# EAGLE design spo2_module_v2.0.1_nov2023 (EAGLE 9.6.2)

## Sheet 1 of 2: Connectors
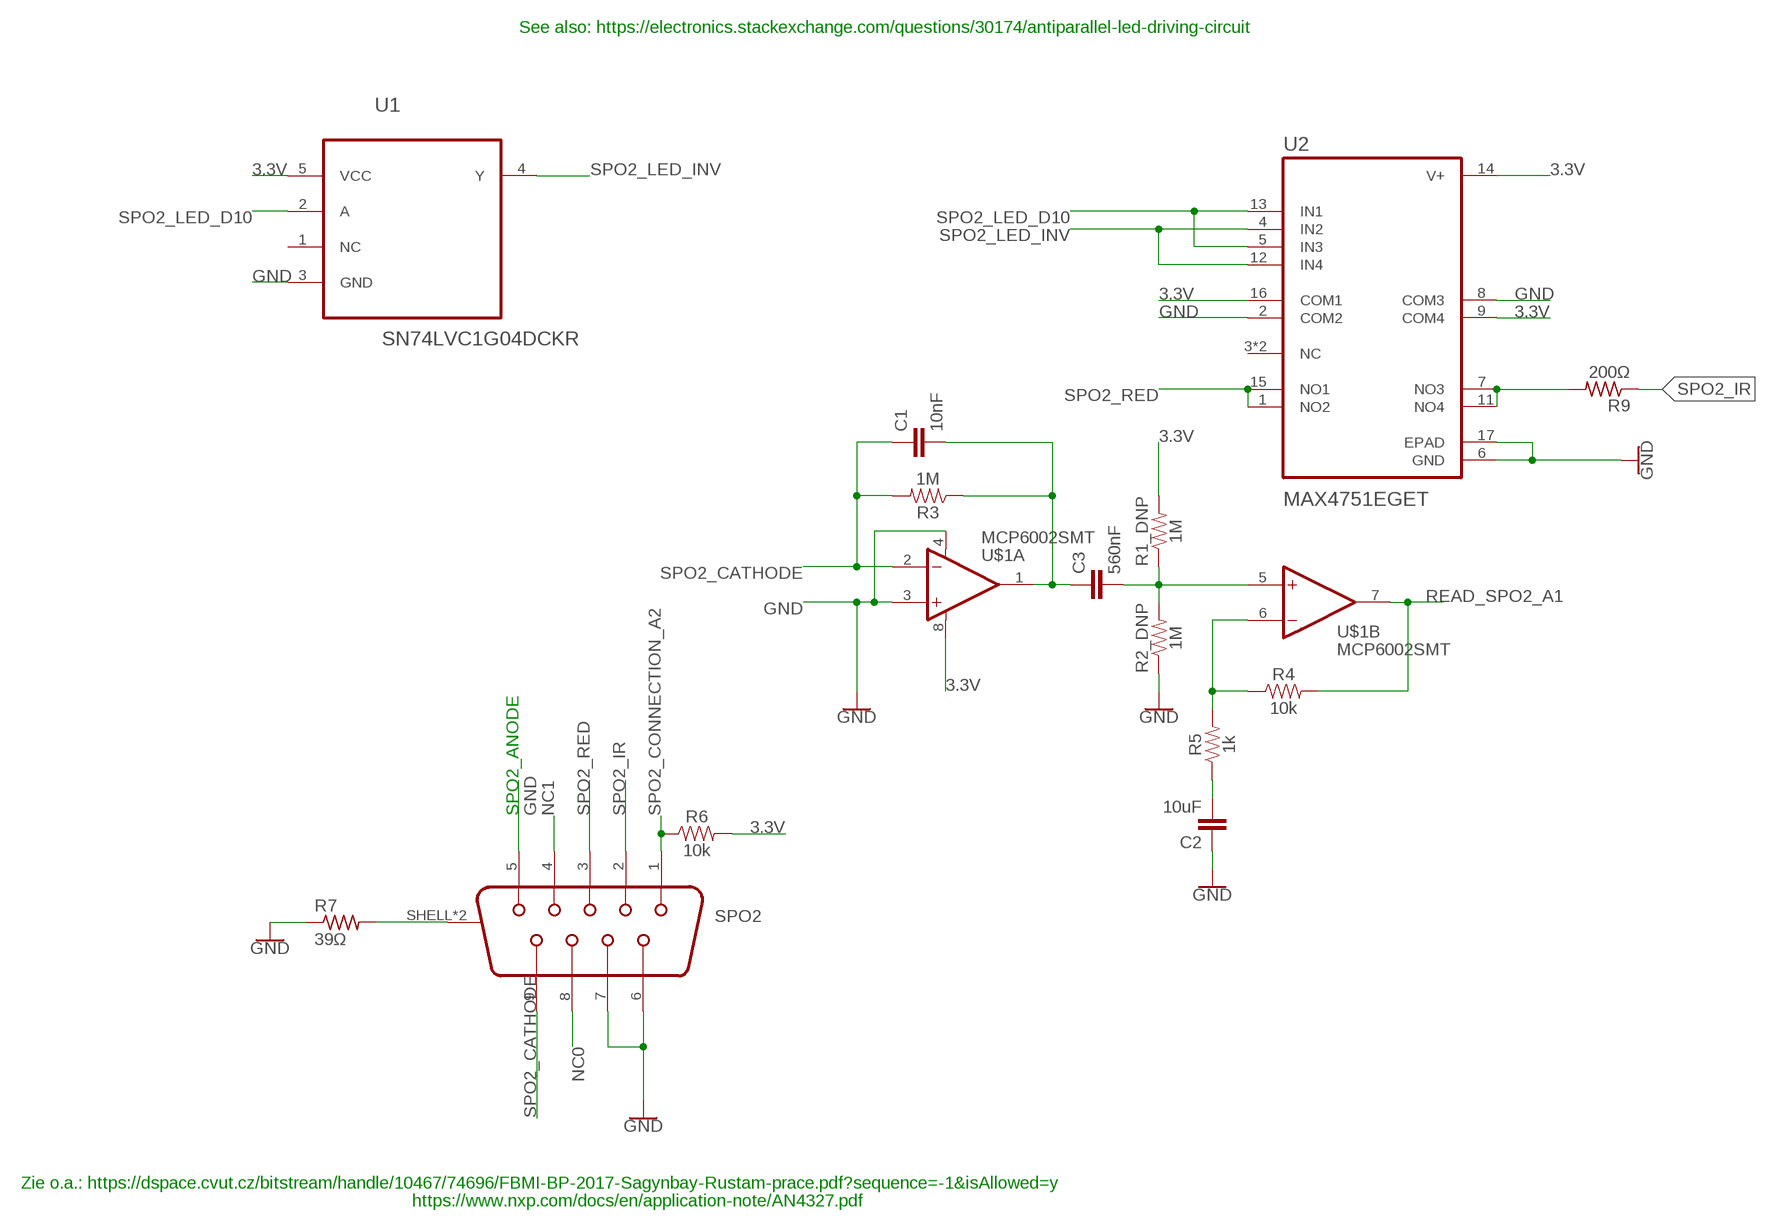
[diagram p0: schematic, sheet 1]

### Parts
C1  10nF  10NF-0603-50V-10%  [0603]
C2  10uF  C-EUC0603  [C0603]
C3  560nF  C-EUC0603  [C0603]
R1_DNP  1M  1MOHM-0603-1/4W-5%  [0603]
R2_DNP  1M  1MOHM-0603-1/4W-5%  [0603]
R3  1M  1MOHM-0603-1/4W-5%  [0603]
R4  10k  10KOHM-0603-1/10W-1%  [0603]
R5  1k  1KOHM-0603-1/10W-1%  [0603]
R6  10k  10KOHM-0603-1/10W-1%  [0603]
R7  39Ω  R-US_R0603  [R0603]
R9  200Ω  R-US_R0603  [R0603]
SPO2  618009231121  [618009231121]
U1  SN74LVC1G04DCKR  [SOT65P210X110-5N]
U2  MAX4751EGET  [QFN50P300X300X90-17N]
U$1  MCP6002SMT  [SOIC8]

### Nets
3.3V: R1_DNP.2 R6.2 U1.5(VCC) U2.9(COM4) U2.14(V+) U2.16(COM1) U$1.8(A:V+) ; also sheet 2
GND: C2.1 R2_DNP.1 R7.1 SPO2.5 SPO2.6 SPO2.7 U1.3(GND) U2.2(COM2) U2.6(GND) U2.8(COM3) U2.17(EPAD) U$1.3(A:+IN) U$1.4(A:V-) ; also sheet 2
N$2: C3.2 R1_DNP.1 R2_DNP.2 U$1.5(B:+IN)
N$4: C1.2 C3.1 R3.1 U$1.1(A:OUT)
N$6: R7.2 SPO2.SHELL1(SHIELD) SPO2.SHELL(SHIELD)
N$7: R4.1 R5.2 U$1.6(B:-IN)
N$9: R9.2 U2.7(NO3) U2.11(NO4)
N$13: C2.2 R5.1
NC0: SPO2.8
NC1: SPO2.4
READ_SPO2_A1: R4.2 U$1.7(B:OUT) ; also sheet 2
SPO2_CATHODE: C1.1 R3.2 SPO2.9 U$1.2(A:-IN)
SPO2_CONNECTION_A2: R6.1 SPO2.1 ; also sheet 2
SPO2_IR: R9.1 SPO2.2
SPO2_LED_D10: U1.2(A) U2.5(IN3) U2.13(IN1) ; also sheet 2
SPO2_LED_INV: U1.4(Y) U2.4(IN2) U2.12(IN4)
SPO2_RED: SPO2.3 U2.1(NO2) U2.15(NO1)
Unconnected: U1.1(NC) U2.3(NC) U2.10(NC)

### Notes on the sheet
- See also: https://electronics.stackexchange.com/questions/30174/antiparallel-led-driving-circuit
- SPO2_ANODE
- Zie o.a.: https://dspace.cvut.cz/bitstream/handle/10467/74696/FBMI-BP-2017-Sagynbay-Rustam-prace.pdf?sequence=-1&isAllowed=y
- https://www.nxp.com/docs/en/application-note/AN4327.pdf

## Sheet 2 of 2: Microcontroller
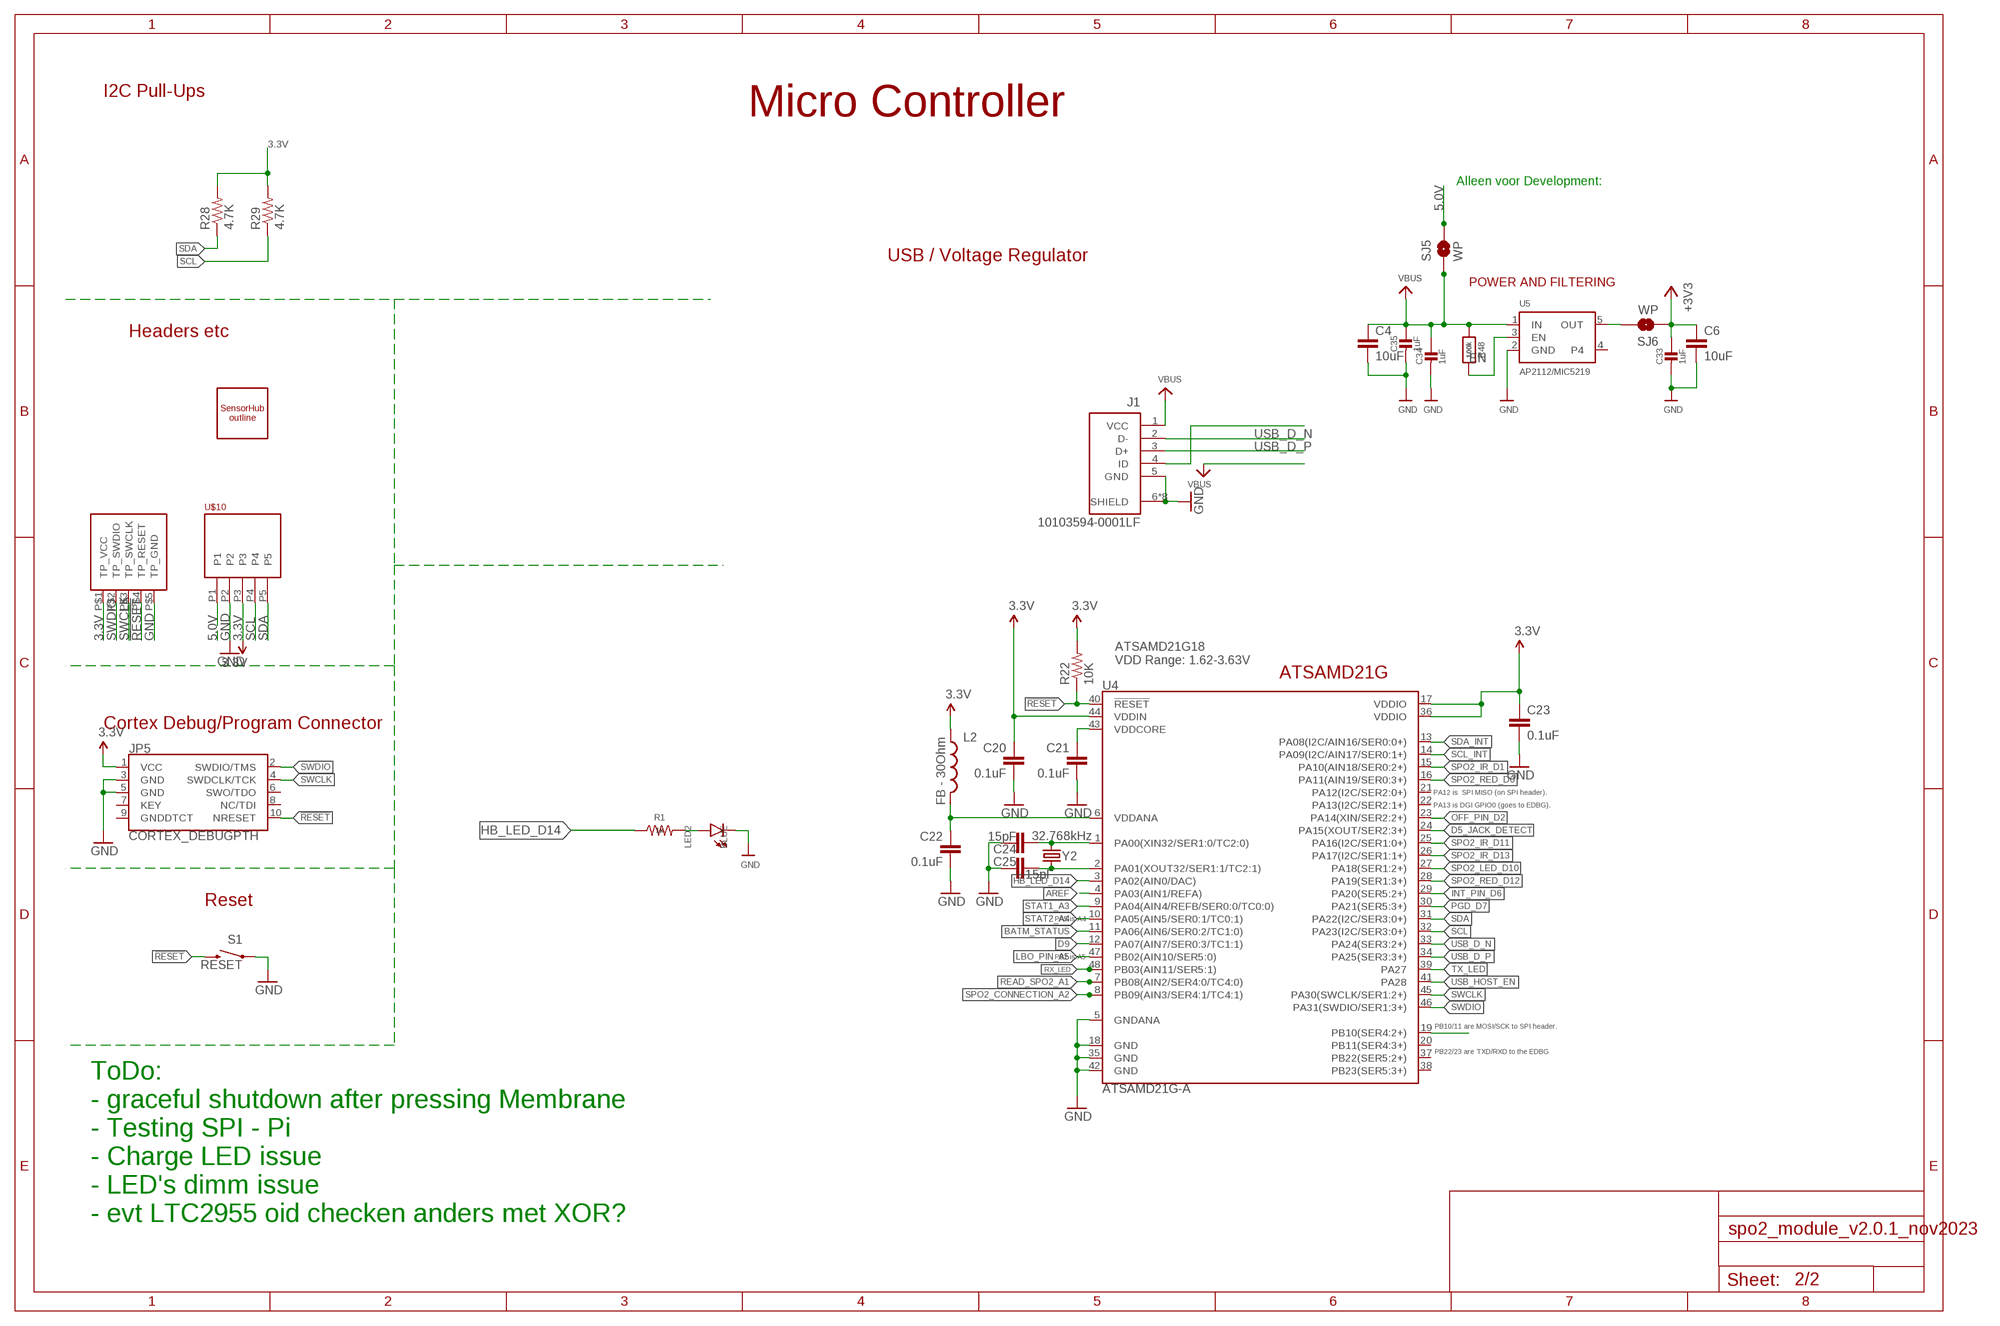
[diagram p1: schematic, sheet 2]

### Parts
C4  10uF  10UF-0603-6.3V-20%  [0603]
C6  10uF  10UF-0603-6.3V-20%  [0603]
C20  0.1uF  0.1UF-16V(+-10%)(0402)  [0402-CAP]
C21  0.1uF  0.1UF-0603-25V-(+80/-20%)  [0603]
C22  0.1uF  0.1UF-16V(+-10%)(0402)  [0402-CAP]
C23  0.1uF  0.1UF-16V(+-10%)(0402)  [0402-CAP]
C24  15pF  15PF-50V(+-5%)(0402)  [0402-CAP]
C25  15pF  15PF-50V(+-5%)(0402)  [0402-CAP]
C33  1uF  CAP_CERAMIC0603_NO  [0603-NO]
C34  1uF  CAP_CERAMIC0603_NO  [0603-NO]
C35  1uF  CAP_CERAMIC0603_NO  [0603-NO]
J1  10103594-0001LF  [AMPHENOL_10103594-0001LF]
JP5  CORTEX_DEBUGPTH  [2X5-PTH-1.27MM]
L2  FB - 30Ohm  INDUCTOR0603  [0603]
LED2  BLUE  LEDCHIP-LED0603  [CHIP-LED0603]
R1  1k  1KOHM-0603-1/10W-1%  [0603]
R22  10K  10KOHM-1/10W-1%(0603)0603  [0603-RES]
R28  4.7K  4.7KOHM-1/10W-1%(0603)  [0603-RES]
R29  4.7K  4.7KOHM-1/10W-1%(0603)  [0603-RES]
R48  100k  RESISTOR_0603_NOOUT  [0603-NO@1]
S1  RESET  SWITCH-MOMENTARY-2SMD-4.6X2.8MM  [TACTILE_SWITCH_SMD_4.6X2.8MM]
SJ5  WP  JUMPER-SMT_2_NO_NO-SILK  [SMT-JUMPER_2_NO_NO-SILK]
SJ6  WP  JUMPER-SMT_2_NO_NO-SILK  [SMT-JUMPER_2_NO_NO-SILK]
U4  ATSAMD21G-A  [TQFP-48]
U5  AP2112/MIC5219  VREG_SOT23-5  [SOT23-5]
U$5  HUB_TESTPINSHUBS  [TEST_PINS]
U$10  PHOENIX_PTSM_M5_TH_I2C++  [PTSM_M5_THRHOLE]
U$12  SENSORHUB_PROFILEUSB_LEFT  [SENSORHUB_OUTLINE_USB_NOTCH_LEFT]
Y2  32.768kHz  CRYSTAL3.2X1.5MM  [CRYSTAL-SMD-3.2X1.5MM]

### Nets
3.3V: C6.1 C20.1 C23.1 C33.1 JP5.1(VCC) L2.1 R22.2 R28.2 R29.2 SJ6.1 U4.17(VDDIO) U4.36(VDDIO) U4.44(VDDIN) U$5.P$1(TP_VCC) U$10.P3 ; supply symbol labelled +3V3 ; also sheet 1
5.0V: SJ5.2 U$10.P1
!RESET: JP5.10(NRESET) R22.1 S1.3 S1.4 U4.40(!RESET!) U$5.P$4(TP_RESET)
AREF: U4.4(PA03(AIN1/REFA))
BATM_STATUS: U4.11(PA06(AIN6/SER0:2/TC1:0))
D5_JACK_DETECT: U4.24(PA15(XOUT/SER2:3+))
D9: U4.12(PA07(AIN7/SER0:3/TC1:1))
EN: R48.2 U5.3(EN)
GND: C4.2 C6.2 C20.2 C21.2 C22.2 C23.2 C24.1 C25.2 C33.2 C34.2 C35.2 J1.5(GND) J1.6(SHIELD) J1.7(SHIELD) J1.8(SHIELD) J1.9(SHIELD) J1.10(SHIELD) J1.11(SHIELD) J1.S1(SHIELD) J1.S2(SHIELD) JP5.3(GND) JP5.5(GND) LED2.C S1.1 S1.2 U4.5(GNDANA) U4.18(GND) U4.35(GND) U4.42(GND) U5.2(GND) U$5.P$5(TP_GND) U$10.P2 ; also sheet 1
HB_LED_D14: R1.1 U4.3(PA02(AIN0/DAC))
INT_PIN_D6: U4.29(PA20(SER5:2+))
LBO_PIN_A5: U4.47(PB02(AIN10/SER5:0))
N$3: J1.4(ID)
N$5: LED2.A R1.2
N$21: U4.19(PB10(SER4:2+))
N$46: C24.2 U4.1(PA00(XIN32/SER1:0/TC2:0)) Y2.P$2
N$47: C25.1 U4.2(PA01(XOUT32/SER1:1/TC2:1)) Y2.P$1
OFF_PIN_D2: U4.23(PA14(XIN/SER2:2+))
OUT: SJ6.2 U5.5(OUT)
PGD_D7: U4.30(PA21(SER5:3+))
READ_SPO2_A1: U4.7(PB08(AIN2/SER4:0/TC4:0)) ; also sheet 1
RX_LED: U4.48(PB03(AIN11/SER5:1))
SCL: R29.1 U4.32(PA23(I2C/SER3:0+)) U$10.P4
SCL_INT: U4.14(PA09(I2C/AIN17/SER0:1+))
SDA: R28.1 U4.31(PA22(I2C/SER3:0+)) U$10.P5
SDA_INT: U4.13(PA08(I2C/AIN16/SER0:0+))
SPO2_CONNECTION_A2: U4.8(PB09(AIN3/SER4:1/TC4:1)) ; also sheet 1
SPO2_IR_D1: U4.15(PA10(AIN18/SER0:2+))
SPO2_IR_D11: U4.25(PA16(I2C/SER1:0+))
SPO2_IR_D13: U4.26(PA17(I2C/SER1:1+))
SPO2_LED_D10: U4.27(PA18(SER1:2+)) ; also sheet 1
SPO2_RED_D0: U4.16(PA11(AIN19/SER0:3+))
SPO2_RED_D12: U4.28(PA19(SER1:3+))
STAT1_A3: U4.9(PA04(AIN4/REFB/SER0:0/TC0:0))
STAT2_A4: U4.10(PA05(AIN5/SER0:1/TC0:1))
SWCLK: JP5.4(SWDCLK/TCK) U4.45(PA30(SWCLK/SER1:2+)) U$5.P$3(TP_SWCLK)
SWDIO: JP5.2(SWDIO/TMS) U4.46(PA31(SWDIO/SER1:3+)) U$5.P$2(TP_SWDIO)
TX_LED: U4.39(PA27)
USB_D_N: J1.2(D-) U4.33(PA24(SER3:2+))
USB_D_P: J1.3(D+) U4.34(PA25(SER3:3+))
USB_HOST_EN: U4.41(PA28)
VBUS: C4.1 C34.1 C35.1 J1.1(VCC) R48.1 SJ5.1 U5.1(IN)
VDDANA: C22.1 L2.2 U4.6(VDDANA)
VDDCORE: C21.1 U4.43(VDDCORE)
Unconnected: JP5.6(SWO/TDO) JP5.7(KEY) JP5.8(NC/TDI) JP5.9(GNDDTCT) U4.20(PB11(SER4:3+)) U4.21(PA12(I2C/SER2:0+)) U4.22(PA13(I2C/SER2:1+)) U4.37(PB22(SER5:2+)) U4.38(PB23(SER5:3+)) U5.4

### Notes on the sheet
- I2C Pull-Ups | Micro Controller
- Alleen voor Development:
- USB / Voltage Regulator
- POWER AND FILTERING
- Headers etc
- ATSAMD21G18
  VDD Range: 1.62-3.63V
- ATSAMD21G
- Cortex Debug/Program Connector
- PA12 is  SPI MISO (on SPI header).
- PA13 is DGI GPIO0 (goes to EDBG).
- Reset
- PA5 is A4
- PB2 is A5
- PB10/11 are MOSI/SCK to SPI header.
- PB22/23 are TXD/RXD to the EDBG
- ToDo:
  - graceful shutdown after pressing Membrane
  - Testing SPI - Pi
  - Charge LED issue
  - LED's dimm issue
  - evt LTC2955 oid checken anders met XOR?

## Library data of the parts
C1 = SparkFun-Capacitors:10NF: 0.01uF/10nF/10,000pF ceramic capacitors A capacitor is a passive two-terminal electrical component used to store electrical energy temporarily in an electric field. CAP-09321; PROD_ID: CAP-00867
C2 C3 = rcl:C-EU: CAPACITOR, European symbol; SPICEPREFIX: C
C4 C6 = SparkFun-Capacitors:10UF: 10.0µF ceramic capacitors A capacitor is a passive two-terminal electrical component used to store electrical energy temporarily in an electric field.; PROD_ID: CAP-11015
C20 C22 C23 = SparkFun-Capacitors:0.1UF-16V(+-10%)(0402); PROD_ID: CAP-12416
C21 = SparkFun-Capacitors:0.1UF: 0.1µF ceramic capacitors A capacitor is a passive two-terminal electrical component used to store electrical energy temporarily in an electric field.; PROD_ID: CAP-00810
C24 C25 = samd21-temp:15PF-50V(+-5%)(0402); PROD_ID: CAP-13063
C33-C35 = microbuilder:CAP_CERAMIC: Ceramic Capacitors For new designs, use the packages preceded by an '_' character since they are more reliable: The following footprints should be used on most boards: _0402 - Standard footprint for regular board layouts _0603 - Standard footprint for regular board layouts _0805 - Standard footprint for regular board layouts _1206 - Standard footprint for regular board layouts For extremely tight-pitch boards where space is at a premium, the following 'micro-pitch' footprints can be used (smaller pads, no silkscreen outline, etc.): _0402MP - Micro-pitch footprint for very dense/compact boards _0603MP - Micro-pitch footprint for very dense/compact boards _0805MP - Micro-pitch footprint for very dense/compact boards _1206MP - Micro-pitch footprint for very dense/compact boards
J1 = 10103594-0001LF:10103594-0001LF: USB - micro B USB 2.0 Receptacle Connector 5 Position Surface Mount, Right Angle; Through Hole Check availability <https://pricing.snapeda.com/parts/10103594-0001LF/AMPHENOL%20ICC%20/%20FCI/view-part?ref=eda>; AVAILABILITY: In Stock; DESCRIPTION: Micro USB 2.0, Input Output Connectors, B TYPE RECEPTACLE; MF: AMPHENOL ICC / FCI; MP: 10103594-0001LF; PACKAGE: None; PRICE: None; PURCHASE-URL: https://pricing.snapeda.com/search/part/10103594-0001LF/?ref=eda
JP5 = samd21-temp:CORTEX_DEBUG: Cortex Debug Connector Datasheet <http://infocenter.arm.com/help/topic/com.arm.doc.faqs/attached/13634/cortex_debug_connectors.pdf>
L2 = SparkFun-Passives:INDUCTOR: Inductors Basic Inductor/Choke - 0603 and 1206. Footprints are not proven and vary greatly between part numbers. INDUCTOR POWER 3.3UH 4.0A SMD 0.197" L x 0.197" W x 0.177" H (5.00mm x 5.00mm x 4.50mm); PROD_ID: RES-07859
LED2 = led:LED: LED OSRAM: - CHIPLED LG R971, LG N971, LY N971, LG Q971, LY Q971, LO R971, LY R971 LH N974, LH R974 LS Q976, LO Q976, LY Q976 LO Q996 - Hyper CHIPLED LW Q18S LB Q993, LB Q99A, LB R99A - SideLED LS A670, LO A670, LY A670, LG A670, LP A670 LB A673, LV A673, LT A673, LW A673 LH A674 LY A675 LS A676, LA A676, LO A676, LY A676, LW A676 LS A679, LY A679, LG A679 - Hyper Micro SIDELED® LS Y876, LA Y876, LO Y876, LY Y876 LT Y87S - SmartLED LW L88C, LW L88S LB L89C, LB L89S, LG L890 LS L89K, LO L89K, LY L89K LS L896, LA L896, LO L896, LY L896 - TOPLED LS T670, LO T670, LY T670, LG T670, LP T670 LSG T670, LSP T670, LSY T670, LOP T670, LYG T670 LG T671, LOG T671, LSG T671 LB T673, LV T673, LT T673, LW T673 LH T674 LS T676, LA T676, LO T676, LY T676, LB T676, LH T676, LSB T676, LW T676 LB T67C, LV T67C, LT T67C, LS T67K, LO T67K, LY T67K, LW E67C LS E67B, LA E67B, LO E67B, LY E67B, LB E67C, LV E67C, LT E67C LW T67C LS T679, LY T679, LG T679 LS T770, LO T770, LY T770, LG T770, LP T770 LB T773, LV T773, LT T773, LW T773 LH T774 LS E675, LA E675, LY E675, LS T675 LS T776, LA T776, LO T776, LY T776, LB T776 LHGB T686 LT T68C, LB T68C - Hyper Mini TOPLED® LB M676 - Mini TOPLED Santana® LG M470 LS M47K, LO M47K, LY M47K Source: http://www.osram.convergy.de LUXEON: - LUMILED® LXK2-PW12-R00, LXK2-PW12-S00, LXK2-PW14-U00, LXK2-PW14-V00 LXK2-PM12-R00, LXK2-PM12-S00, LXK2-PM14-U00 LXK2-PE12-Q00, LXK2-PE12-R00, LXK2-PE12-S00, LXK2-PE14-T00, LXK2-PE14-U00 LXK2-PB12-K00, LXK2-PB12-L00, LXK2-PB12-M00, LXK2-PB14-N00, LXK2-PB14-P00, LXK2-PB14-Q00 LXK2-PR12-L00, LXK2-PR12-M00, LXK2-PR14-Q00, LXK2-PR14-R00 LXK2-PD12-Q00, LXK2-PD12-R00, LXK2-PD12-S00 LXK2-PH12-R00, LXK2-PH12-S00 LXK2-PL12-P00, LXK2-PL12-Q00, LXK2-PL12-R00 Source: www.luxeon.com KINGBRIGHT: KA-3528ASYC Source: www.kingbright.com
R1 R5 = SparkFun-Resistors:1KOHM: 1kΩ resistor A resistor is a passive two-terminal electrical component that implements electrical resistance as a circuit element. Resistors act to reduce current flow, and, at the same time, act to lower voltage levels within circuits. - Wikipedia; PROD_ID: RES-07856
R1_DNP R2_DNP R3 = SparkFun-Resistors:1MOHM: 1MΩ resistor A resistor is a passive two-terminal electrical component that implements electrical resistance as a circuit element. Resistors act to reduce current flow, and, at the same time, act to lower voltage levels within circuits. - Wikipedia; PROD_ID: RES-07868
R4 R6 = SparkFun-Resistors:10KOHM: 10kΩ resistor A resistor is a passive two-terminal electrical component that implements electrical resistance as a circuit element. Resistors act to reduce current flow, and, at the same time, act to lower voltage levels within circuits. - Wikipedia; PROD_ID: RES-00824
R7 = adafruit:R-US_: RESISTOR, American symbol
R9 = rcl:R-US_: RESISTOR, American symbol; SPICEPREFIX: R
R22 = SparkFun-Resistors:10KOHM-1/10W-1%(0603): RES-00824; PROD_ID: RES-00824
R28 R29 = SparkFun-Resistors:4.7KOHM-1/10W-1%(0603): RES-07857; PROD_ID: RES-07857
R48 = microbuilder:RESISTOR: Resistors For new designs, use the packages preceded by an '_' character since they are more reliable: The following footprints should be used on most boards: _0402 - Standard footprint for regular board layouts _0603 - Standard footprint for regular board layouts _0805 - Standard footprint for regular board layouts _1206 - Standard footprint for regular board layouts For extremely tight-pitch boards where space is at a premium, the following 'micro-pitch' footprints can be used (smaller pads, no silkscreen outline, etc.): _0402MP - Micro-pitch footprint for very dense/compact boards _0603MP - Micro-pitch footprint for very dense/compact boards _0805MP - Micro-pitch footprint for very dense/compact boards _1206MP - Micro-pitch footprint for very dense/compact boards
S1 = samd21-temp:SWITCH-MOMENTARY-2: Various NO switches- pushbuttons, reed, etc; PROD_ID: SWCH-13065
SJ5 SJ6 = SparkFun-Jumpers:JUMPER-SMT_2_NO: Normally open jumper This jumper has two pads in close proximity to each other. Apply solder to close the connection. Round pads are easier to solder for beginners, but are a lot larger. SparkFun Product that uses the round pads: SparkFun EL Sequencer <https://www.sparkfun.com/products/12781>
SPO2 = InputOutputIO (rev19a):618009231121: WR-DSUB 8.08mm Female Angled PCB Connector with Hex Screw, 9 Pins=>Code : Con_I-O_DSUB_PCB_Female_w-screw_618009231121 <http://katalog.we-online.de/media/images/eican/Con_I-O_DSUB_PCB_Female_w-screw_6180xx231121_pf2.jpg> Details see: http://katalog.we-online.de/en/em/DSUB_FEMALE_ANGLED_PCB_CONNECTOR_W_HEX_SCREW_8_08MM_6180XX231121 Created 2014-07-10, Karrer Zheng 2014 (C) Würth Elektronik
U1 = SN74LVC1G04DCKR:SN74LVC1G04DCKR: SINGLE INVERTER GATE; AVAILABILITY: Unavailable; DESCRIPTION: Inverter 1-Element CMOS 5-Pin SC-70 T/R; MF: Texas Instruments; MP: SN74LVC1G04DCKR; PACKAGE: SC-70-5 Texas Instruments; PRICE: None
U2 = MAX4751EGET:MAX4751EGET; AVAILABILITY: Unavailable; DESCRIPTION: Analog Switch Quad SPST 16-Pin QFN; MF: Maxim Integrated; MP: MAX4751EGE+; PACKAGE: QFN-16 Maxim; PRICE: None
U4 = samd21-temp:ATSAMD21G: Atmel SAMD21G SMART ARM-Based Microcontroller The Atmel ® | SMART ™ SAM D21 is a series of low-power microcontrollers using the 32-bit ARM ® Cortex ® -M0+ processor, and ranging from 32- to 64-pins with up to 256KB Flash and 32KB of SRAM. The SAM D21 devices operate at a maximum frequency of 48MHz and reach 2.46 CoreMark/MHz. They are designed for simple and intuitive migration with identical peripheral modules, hex compatible code, identical linear address map and pin compatible migration paths between all devices in the product series. All devices include intelligent and flexible peripherals, Atmel Event System for inter-peripheral signaling, and support for capacitive touch button, slider and wheel user interfaces.; PROD_ID: IC-13064
U5 = microbuilder:VREG_SOT23-5: SOT23-5 Fixed Voltage Regulators Part Current Out V Out V In V Dropout θJA (°C/W) TJ (°C) Digikey Part No. ADP121 150mA 3.3V 3.4-5.5V 0.09V @ 150mA -- -- ADP121-AUJZ33R7CT-ND ADP121 150mA 3.0V 3.1-5.5V 0.09V @ 150mA -- -- ADP121-AUJZ30R7CT-ND ADP122 300mA 3.3V 3.4-5.5V 0.085V @ 300mA -- -- ADP122AUJZ-3.3-R7CT-ND ADP1712 300mA 3.3V 3.5-5.5V 0.17V @ 300mA -- -- ADP1712AUJZ-3.3-R7TR-ND AP7311 (Low Cost) 150mA 3.3V 3.5-6V 0.15V @ 150mA -- -- AP7311-33WG-7DICT-ND LD39015M18R 150mA 1.8V 1.9V-5.5V 0.08V @ 100mA -- -- 497-6977-1-ND LP2985A-33DBVR 150mA 3.3V 3.3-16V 0.28V @ 150mA 206 150 296-18479-1-ND MCP1824T-3302E/OT 300mA 3.3V 3.5V-6V 0.2V @ 300mA -- -- MCP1824T-3302E/OTCT-ND MIC5205-2.5YM5 TR 150mA 2.5V 2.7-16V 0.165V @ 150mA -- -- 576-1257-2-ND MIC5205-3.0YM5 TR 150mA 3.0V 3.2V-16V 0.165V @ 150mA -- -- 576-1258-2-ND MIC5205-3.3YM5 TR 150mA 3.3V 3.5V-16V 0.165V @ 150mA -- -- 576-1259-2-ND TPS780330220 150mA 3.3V+2.2V 3.6-5.5V 250mV Max -- -- 296-23332-1-ND TDA3663/N1,135 100mA 3.3V 3.5-45V 0.18V @ 50mA -- -- 568-5343-1-ND Max operating temp can be calculated using θJA, TJ (max junction temperature), and power in watts. Set the "Maximum Ambient Temperature" until it reaches TJ ("Max Junction Temperature"), which is the absolute limit for safe use of the regulator: Heat Sink Temperature Calculator <http://www.daycounter.com/Calculators/Heat-Sink-Temperature-Calculator.phtml> For example, With 12V source into a 3.3V LP2985 and a 30mA load, we are dissipating (12V-3.3V) * 0.03A = 0.261W. With a θJA of 206 °C/W, a TJ of 150°C, and 261mW we can safely use the chip without a heat sink up to 75°C (=147.1°C Junction Temperature).
U$1 = adam - ics:MCP6002: Dual General Op Amp 1.8V min supply 1MHz (6V/us)
U$5 = jk_customs:HUB_TESTPINS
U$10 = jk_customs:PHOENIX_PTSM_M5_TH: Datasheet Phoenix PTSM 0,5/ 5-HH-2,5-THR R32 <https://www.phoenixcontact.com/online/portal/us?uri=pxc-oc-itemdetail:pid=1778654&library=usen&pdfmode=direct&pdflanguage=en>
U$12 = jk_customs:SENSORHUB_PROFILE
Y2 = samd21-temp:CRYSTAL: Various standard crystals. Proven footprints.; PROD_ID: XTAL-13062

## Board
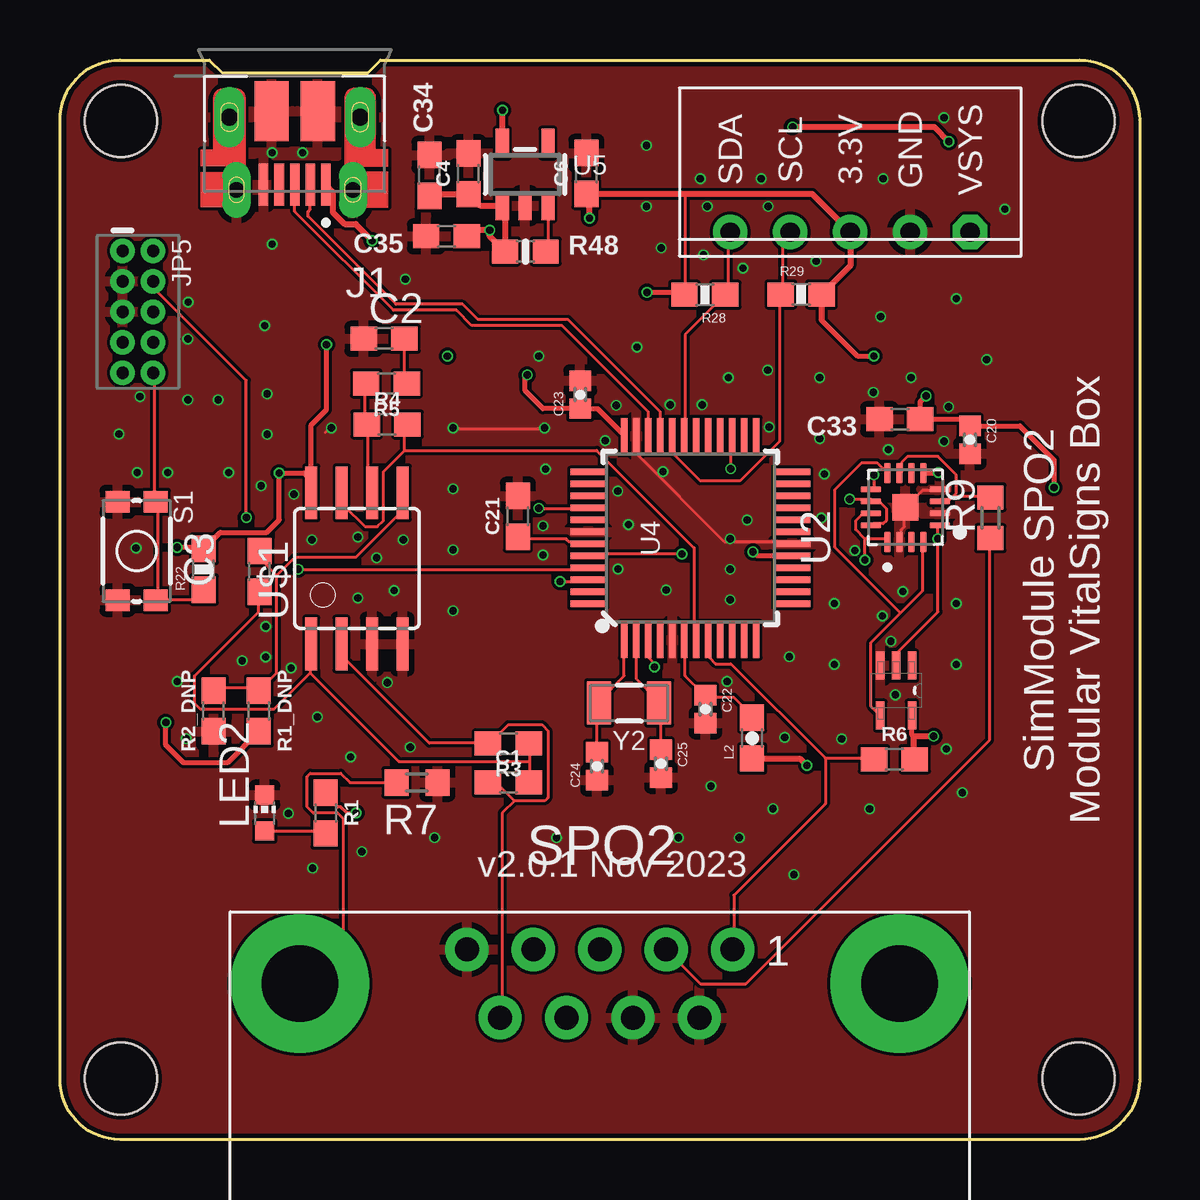
[diagram p2: board, top side]
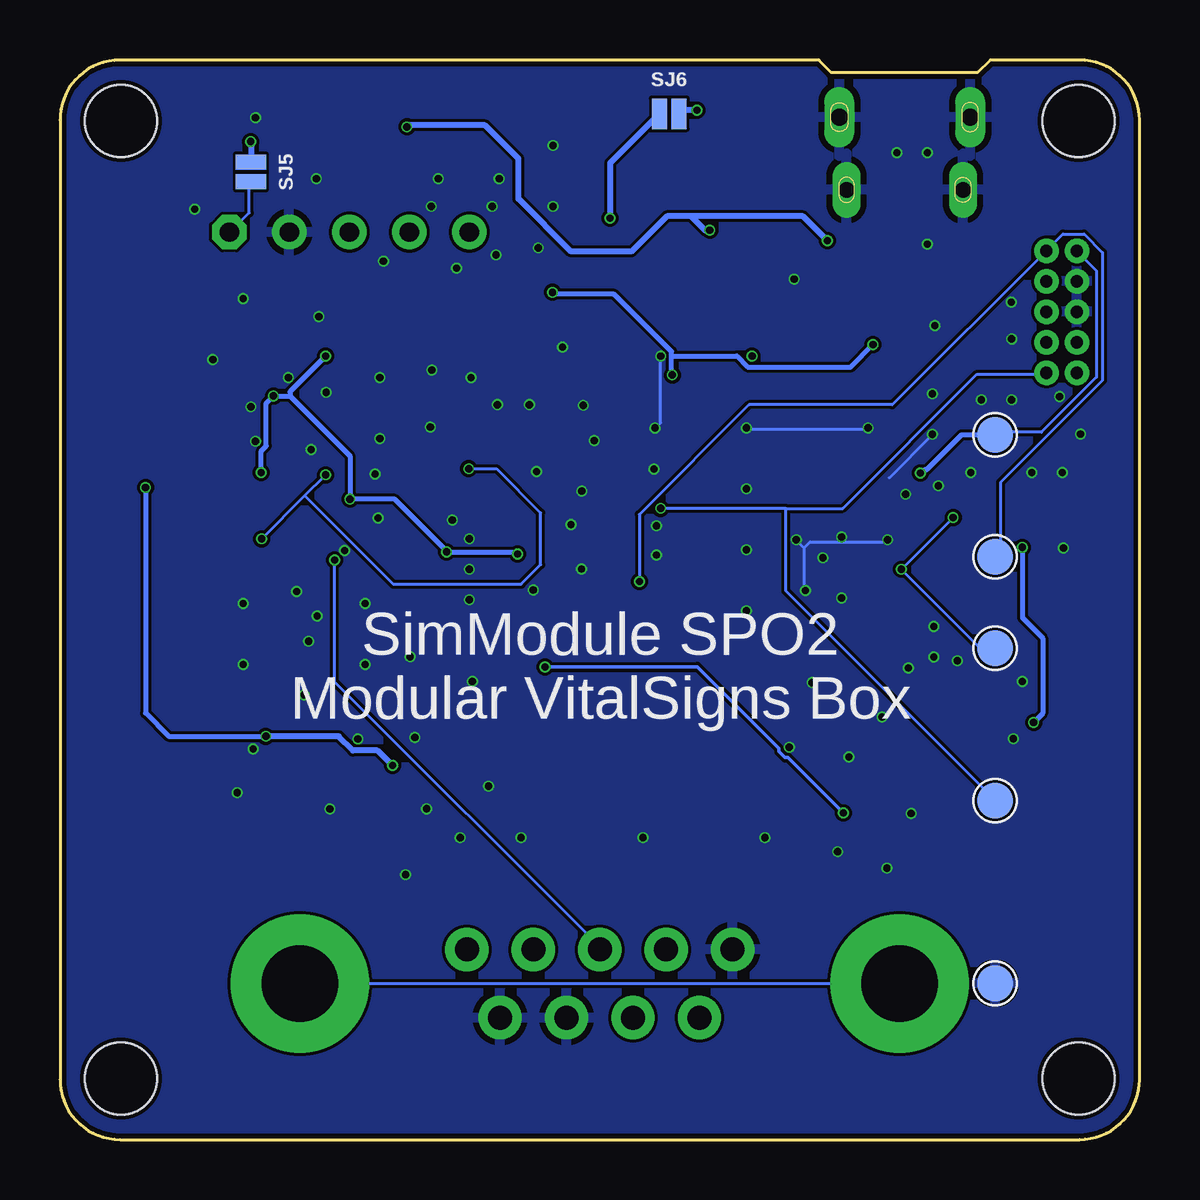
[diagram p3: board, bottom side, seen from below]

Size 45 x 45 mm. Coordinates in mm from the lower left corner, seen from the top.
Copper layers (1*16): Top 0.035mm / dielectric 1.6mm / Bottom 0.035mm
Design rules "jlcpcb-2layers_2023": minimum track width 5mil, minimum drill 0.3mm, track to track 5mil, track to pad 5mil, pad to pad 5mil, via to via 5mil, smd to smd 5mil, copper to edge 0.2mm, drill to drill 6mil, minimum pad ring 10mil, minimum via ring 3mil, stop-mask expansion 4mil, vias tented up to drill 20mil, thermal gap 10mil

### Footprints (pad centres in the part's own frame; a part is rotated, then mirrored left to right if it is on the bottom)
0603 = smd 1.1 x 1: 1 -0.85,0; 2 0.85,0
C0603 = smd 1.1 x 1: 1 -0.85,0; 2 0.85,0
0402-CAP = smd 0.85 x 0.9: 1 -0.58,0; 2 0.58,0
0603-NO = smd 1.1 x 1: 1 -0.85,0; 2 0.85,0
AMPHENOL_10103594-0001LF = smd 0.4 x 1.75: 1 -1.3,2.825; 2 -0.65,2.825; 3 0,2.825; 4 0.65,2.825; 5 1.3,2.825 | drill 0.65 pad 0.73 long: 6 -2.425,3.03; 7 2.425,3.03 | drill 0.7 pad 1.2 long: 8 -2.725,0; 9 2.725,0 | smd 1.05 x 2.1 bottom: 10 -2.425,3.03; 11 2.425,3.03 | smd 1.425 x 2.5: S1 -0.963,-0.25; S2 0.963,-0.25
2X5-PTH-1.27MM = drill 0.508 pad 1: 1 -2.54,-0.635; 2 -2.54,0.635; 3 -1.27,-0.635; 4 -1.27,0.635; 5 0,-0.635; 6 0,0.635; 7 1.27,-0.635; 8 1.27,0.635; 9 2.54,-0.635; 10 2.54,0.635
CHIP-LED0603 = smd 0.8 x 0.8: A 0,-0.75; C 0,0.75
R0603 = smd 1 x 1.1: 1 -0.85,0; 2 0.85,0
0603-RES = smd 1.1 x 1: 1 -0.85,0; 2 0.85,0
0603-NO@1 = smd 1.075 x 1: 1 -0.85,0; 2 0.85,0
TACTILE_SWITCH_SMD_4.6X2.8MM = smd 0.9 x 1: 1 -2.05,-0.8; 2 2.05,-0.8; 3 2.05,0.8; 4 -2.05,0.8
SMT-JUMPER_2_NO_NO-SILK = smd 0.635 x 1.27: 1 -0.406,0; 2 0.406,0
618009231121 = drill 1: 1 5.54,1.42; 2 2.77,1.42; 3 0,1.42; 4 -2.77,1.42; 5 -5.54,1.42; 6 4.155,-1.42; 7 1.385,-1.42; 8 -1.385,-1.42; 9 -4.155,-1.42 | drill 3.2: SHELL -12.5,0; SHELL1 12.5,0
SOT65P210X110-5N = smd 1.168 x 0.356: 1 -1.041,0.66; 2 -1.041,0; 3 -1.041,-0.66; 4 1.041,-0.66; 5 1.041,0.66
QFN50P300X300X90-17N = smd 0.86 x 0.26: 1 -1.435,0.75; 2 -1.435,0.25; 3 -1.435,-0.25; 4 -1.435,-0.75; 9 1.435,-0.75; 10 1.435,-0.25; 11 1.435,0.25; 12 1.435,0.75 | smd 0.26 x 0.86: 5 -0.75,-1.435; 6 -0.25,-1.435; 7 0.25,-1.435; 8 0.75,-1.435; 13 0.75,1.435; 14 0.25,1.435; 15 -0.25,1.435; 16 -0.75,1.435 | smd 1.1 x 1.1: 17 0,0
TQFP-48 = smd 1.5 x 0.28: 1 -4.25,2.75; 2 -4.25,2.25; 3 -4.25,1.75; 4 -4.25,1.25; 5 -4.25,0.75; 6 -4.25,0.25; 7 -4.25,-0.25; 8 -4.25,-0.75; 9 -4.25,-1.25; 10 -4.25,-1.75; 11 -4.25,-2.25; 12 -4.25,-2.75; 25 4.25,-2.75; 26 4.25,-2.25; 27 4.25,-1.75; 28 4.25,-1.25; 29 4.25,-0.75; 30 4.25,-0.25; 31 4.25,0.25; 32 4.25,0.75; 33 4.25,1.25; 34 4.25,1.75; 35 4.25,2.25; 36 4.25,2.75 | smd 0.28 x 1.5: 13 -2.75,-4.25; 14 -2.25,-4.25; 15 -1.75,-4.25; 16 -1.25,-4.25; 17 -0.75,-4.25; 18 -0.25,-4.25; 19 0.25,-4.25; 20 0.75,-4.25; 21 1.25,-4.25; 22 1.75,-4.25; 23 2.25,-4.25; 24 2.75,-4.25; 37 2.75,4.25; 38 2.25,4.25; 39 1.75,4.25; 40 1.25,4.25; 41 0.75,4.25; 42 0.25,4.25; 43 -0.25,4.25; 44 -0.75,4.25; 45 -1.25,4.25; 46 -1.75,4.25; 47 -2.25,4.25; 48 -2.75,4.25
SOT23-5 = smd 0.55 x 1.2: 1 -0.95,-1.3; 2 0,-1.3; 3 0.95,-1.3; 4 0.95,1.3; 5 -0.95,1.3
SOIC8 = smd 0.5 x 2.2: 1 -1.905,-3.154; 2 -0.645,-3.154; 3 0.625,-3.154; 4 1.895,-3.154; 5 1.905,3.154; 6 0.635,3.154; 7 -0.635,3.154; 8 -1.905,3.154
TEST_PINS = smd 1.5 x 1.5 bottom: P$1 6.35,29.21; P$2 6.35,24.13; P$3 6.35,20.32; P$4 6.35,13.97; P$5 6.35,6.35
PTSM_M5_THRHOLE = drill 0.8 octagon: P1 5,1 | drill 0.8: P2 2.5,1; P3 0,1; P4 -2.5,1; P5 -5,1
SENSORHUB_OUTLINE_USB_NOTCH_LEFT = hole 3: -19.96,19.96; 19.96,19.96; -19.96,-19.96; 19.96,-19.96
CRYSTAL-SMD-3.2X1.5MM = smd 1 x 1.8: P$1 -1.25,0; P$2 1.25,0

### Placement (x,y rotation side)
C1  18.69,14.88 0 top
C2  13.51,33.38 0 top
C3  8.33,23.68 90 top
C4  17.03,40.25 90 top
C6  21.94,40.27 90 top
C20  37.93,29.17 270 top
C21  19.08,25.98 90 top
C22  26.91,17.94 270 top
C23  21.69,31.05 90 top
C24  22.39,15.57 90 top
C25  25.05,15.67 270 top
C33  35.01,30.03 180 top
C34  15.4,40.19 90 top
C35  16.11,37.65 180 top
J1  9.79,42.62 180 top
JP5  3.25,34.5 270 top
L2  28.85,16.73 90 top
LED2  8.53,13.61 0 top
R1  11.07,13.61 270 top
R1_DNP  8.29,17.86 270 top
R2_DNP  6.41,17.86 90 top
R3  18.69,16.51 180 top
R4  13.64,29.8 0 top
R5  13.61,31.52 180 top
R6  34.78,15.85 0 top
R7  14.88,14.88 180 top
R9  38.78,25.92 90 top
R22  5.99,23.77 90 top
R28  26.88,35.21 180 top
R29  30.89,35.23 0 top
R48  19.4,37.02 0 top
S1  3.2,24.53 270 top
SJ5  37.04,40.33 270 bottom
SJ6  19.6,42.76 0 bottom
SPO2  22.5,6.5 0 top
U1  34.86,18.72 270 top
U2  35.24,26.35 90 top
U4  26.27,25.08 90 top
U5  19.39,40.23 0 top
U$1  12.38,23.81 0 top
U$5  -0.33,0.16 0 top
U$10  32.94,36.83 0 top
U$12  22.5,22.5 0 top
Y2  23.72,18.19 180 top

### Tracks (layer width: path | path; a pad name or v marks a point on that pad's centre or on a via)
3.3V  (via drill 0.3)
  Top 0.127: U2.16 33.93,25.68 34.31,25.68 34.44,25.8 34.44,26.31 34.18,26.56 33.93,26.56 U2.14 33.8,26.69 v32.91,26.69 | 26.06,39.42 26.06,35.33 26.04,35.26 R28.2 | v25.93,24.41 22.12,24.41 U4.44 | 23.52,29.36 U4.36 | 5.75,24.68 5.75,24.75 R22.2
  Top 0.2: 23.52,29.36 22.41,30.47 C23.1 20.13,30.47 19.39,31.21 19.39,31.78 v19.48,31.87 | v24.47,35.31 25.98,35.31 26.04,35.26 | v11.11,33.13 11.11,30.42 10.47,29.79 10.47,27.49 | v36.1,31 35.86,30.75 C33.1 37.65,30.03 C20.1 40.02,29.75 41.44,28.33 v41.44,27.17 | U4.17 29.06,24.33 v28.89,24.5 | U2.9 36.6,27.78 v36.61,27.8 | U1.5 35.52,16.86 35.57,16.81 35.57,15.91 R6.2 | 31.74,34.16 33.24,32.66 v33.93,32.66 | 5.75,24.68 v4.89,24.68 | R1_DNP.2 6.98,15.71 5.15,15.71 4.41,16.44 v4.41,17.38 | R22.2 6.68,25.31 8.62,25.31 9.14,25.83 v9.14,27.78 10.18,27.78 10.47,27.49 | U$1.8 10.47,27.49
  Top 0.254: v22.07,38.4 22.07,39.29 C6.1 26.06,39.42 31.35,39.42 U$10.P3 32.94,36.42 R29.2 31.74,34.16 | L2.1 30.84,15.88 v31.14,15.59 | v36.42,16.81 35.58,16.81 35.58,15.91 35.57,15.91
  Bottom 0.127: U$5.P$1 5.99,29.48 4.09,29.48 1.8,31.77 1.8,36.22 2.56,36.98 JP5.1
  Bottom 0.2: v19.48,31.87 19.51,31.9 19.51,32.66 | 19.51,32.66 19.51,32.85 21.9,35.24 24.39,35.24 v24.47,35.31 | 19.51,32.66 16.79,32.66 16.34,32.21 12.03,32.21 v11.11,33.13 | U$5.P$1 7.43,29.37 8.87,27.92 8.95,27.92 9.11,27.76 v9.14,27.78 | 35.42,31 v36.1,31 36.4,30.7 36.4,28.92 36.61,28.7 v36.61,27.8 | v28.89,24.5 28.85,24.5 | 28.85,24.5 26.02,24.5 v25.93,24.41 | 28.85,24.5 31.05,26.69 v32.91,26.69 32.91,28.49 35.42,31 | v41.44,27.17 41.44,17.78 40.47,16.81 v36.42,16.81 | v33.93,32.66 35.42,31.17 35.42,31 | v4.89,24.68 4.89,21.75 4.03,20.9 4.03,17.76 v4.41,17.38
  Bottom 0.254: SJ6.1 22.07,40.7 v22.07,38.4 | v31.14,15.59 31.76,16.22 32.78,16.22 33.38,16.81 v36.42,16.81
5.0V
  Bottom 0.127: SJ5.2 37.11,39.9 37.11,38.63 37.87,37.87 U$10.P1
!RESET  (via drill 0.3)
  Top 0.127: v19.96,26.31 21.99,26.31 U4.40 | 4.09,22.5 5.61,22.5 5.99,22.88 R22.1 | 4.09,22.5 4.09,26.56 S1.4 3.96,26.69 3.96,31.9 JP5.10 | 4.09,22.5 S1.3
  Bottom 0.127: 14.75,26.31 v19.96,26.31 | 14.75,26.31 14.75,22.88 6.12,14.24 U$5.P$4 | JP5.10 3.96,31.9 6.78,31.9 12.37,26.31 14.75,26.31
EN
  Top 0.127: R48.2 20.34,37.11 20.34,38.88 U5.3
GND  (via drill 0.3)
  Top 0.127: U2.2 35.07,25.04 35.07,25.42 35.2,25.55 35.2,26.31 U2.17 35.96,27.07 36.6,27.07 U2.8 | U4.35 24.02,29.23 24.02,28.6 27.71,24.91 30.5,24.91 U4.18 | J1.S1 10.82,42.82 10.82,42.71 | 11.07,29.48 11.2,29.61 v11.31,29.66 | v16.39,29.66 16.4,29.61 20.09,29.61 v20.2,29.66
  Bottom 0.127: 13.99,24.66 13.99,22.88 v13.93,22.88 | 13.99,24.66 14.24,24.91 v14.31,25 | 13.99,24.66 13.74,24.91 10.56,24.91 v10.5,25 10.44,25.04 | v19.96,32.66 19.96,29.87 20.09,29.74 v20.2,29.66 | v11.31,29.66 11.32,29.61 16.28,29.61 v16.39,29.66 | 10.44,27.58 8.66,29.36 v8.63,29.4
  other vias: 8.53,33.93 14.4,35.86 16.39,27.12 16.39,24.58 16.39,22.04 14.6,16.35 12.11,15.95 9.52,13.6 12.58,12 10.54,11.31 15.62,12.58 20.7,12.58 25.78,12.58 28.32,12.58 27.81,19.1 27.94,23.77 25.27,22.91 23.69,25.64 20.24,27.95 24.05,33.03 27.86,31.76 31.67,31.76 35.48,31.76 34.21,34.3 31.52,36.61 29.52,38.9 26.98,38.9 24.44,38.9 24.44,41.44 28.65,25.83 25.14,27.85 22.73,29.13 23.25,27.03 23.26,23.78 20.14,24.37 20.14,25.59 26.77,30.63 25.43,30.63 23.19,30.6 29.56,29.7 29.5,32.08 28.47,36.32 26.82,36.88 25.07,37.17 26.69,40.05 29.23,40.05 34.31,40.05 39.39,38.78 36.85,42.59 37.36,35.05 38.63,32.51 32.28,22.35 32.28,19.81 37.36,22.35 37.36,19.81 34.82,18.54 34.29,21.83 30.41,20.13 32.58,16.7 30.21,16.76 27.14,14.73 29.71,13.79 30.59,11.04 33.75,13.78 36.95,16.28 37.61,14.46 31.67,29.22 31.75,25.9 31.86,27.75 33.13,24.56 34.53,28.76 37.04,30.54 36.85,29.1 33.9,31.15 35.14,22.84 34.64,20.77 27.94,25.04 27.94,22.5 13.2,24.25 12.42,25.12 12.42,22.58 8.57,21.38 8.57,20.11 9.63,19.66 10.73,17.61 13.65,19.05 7.59,19.96 4.89,19.1 5.27,16.71 3.17,24.66 4.49,27.8 3.22,27.8 7.03,27.8 6.6,30.83 5.33,30.83 5.33,33.37 5.34,34.91 8.63,31.09 3.34,30.97 2.46,29.41 8.85,41.13 10.12,41.13 8.85,37.32 8.39,27.25 9.75,26.89
  pour Top: -16.87,53.18 -16.87,-5.44 55.52,-5.44 55.52,55.52
  pour Bottom: -21.95,57.56 -21.95,-10.52 59.33,-10.52 59.33,57.56
HB_LED_D14  (via drill 0.3)
  Top 0.127: 11.71,13.86 11.58,13.86 11.07,14.37 R1.1 | 24.79,19.83 24.53,20.09 24.53,20.72 U4.3
  Top 0.152: 24.79,19.83 v24.79,19.7 | v12.34,13.61 11.96,13.61 11.71,13.86
  Bottom 0.152: v24.79,19.7 18.43,19.7 15.03,16.3 15.03,16.18 14.78,15.92 14.65,15.92 v12.34,13.61
N$2
  Top 0.127: 9.04,23.52 8.4,24.15 8.4,24.41 C3.2 | 9.04,23.52 9.04,19.45 8.4,18.82 R1_DNP.1 8.28,18.82 6.5,18.82 R2_DNP.2 | 9.04,23.52 9.8,24.28 12.34,24.28 14.24,26.18 14.24,26.95 U$1.5
N$4
  Top 0.127: 19.58,15.77 19.58,16.4 R3.1 | 19.58,15.77 19.58,14.88 C1.2 | 10.44,19.45 8.91,17.93 5.86,17.93 5.61,18.18 5.61,19.32 8.28,21.99 8.28,22.75 C3.1 | 10.44,19.45 10.44,20.59 U$1.1 | 19.58,15.77 14.12,15.77 10.44,19.45
N$5
  Top 0.127: LED2.A 8.53,12.85 11.07,12.85 R1.2
N$6
  Top 0.127: R7.2 12.09,14.88 11.71,15.26 10.44,15.26 10.31,15.13 10.31,13.86 10.56,13.61 11.58,13.61 11.83,13.36 11.83,8.4 10.05,6.62 SPO2.SHELL
  Bottom 0.127: SPO2.SHELL1 34.95,6.5 10.05,6.5 SPO2.SHELL
N$7
  Top 0.127: R5.2 12.72,31.52 12.72,29.87 R4.1 12.85,29.74 12.85,27.2 12.97,27.07 U$1.6
N$9
  Top 0.127: 37.23,26.82 37.11,26.69 36.72,26.69 U2.7 | 37.23,26.82 37.36,26.95 37.36,27.71 36.6,28.47 35.33,28.47 35.07,28.21 35.07,27.83 U2.11 | 37.23,26.82 38.76,26.82 R9.2
N$10  (via drill 0.3)
  other vias: 16.15,32.66
N$13
  Top 0.127: C2.2 14.37,33.3 14.37,31.52 R5.1
N$46
  Top 0.127: C24.2 22.37,16.15 22.37,18.18 Y2.P$2 22.5,18.31 23.52,19.32 23.52,20.72 U4.1
N$47
  Top 0.127: C25.1 25.04,16.28 25.04,18.18 Y2.P$1 24.91,18.31 24.02,19.2 24.02,20.72 U4.2
OUT  (via drill 0.3)
  Top 0.254: U5.5 v18.44,42.9 v18.45,42.91
  Bottom 0.254: v18.45,42.91 19.05,42.91 SJ6.2
READ_SPO2_A1
  Top 0.127: 14.37,28.72 14.37,29.74 R4.2 | 14.37,28.72 13.48,27.83 13.48,25.8 13.23,25.55 12.72,25.55 11.83,26.44 11.83,26.95 U$1.7 | 14.37,28.72 22.37,28.72 26.44,24.66 26.44,20.85 U4.7
SCL
  Top 0.127: U$10.P4 30.37,37.74 30.12,37.49 30.12,35.33 R29.1 29.99,35.2 29.99,29.1 28.34,27.45 26.69,27.45 25.55,28.6 25.55,29.23 U4.32
SDA
  Top 0.127: U$10.P5 27.83,37.74 27.83,35.33 R28.1 27.71,35.2 26.06,33.55 26.06,29.36 U4.31
SPO2_CATHODE
  Top 0.127: C1.1 18.18,14.88 18.94,14.12 | 18.94,14.12 20.21,14.12 20.34,14.24 20.34,17.04 20.09,17.29 18.69,17.29 17.93,16.53 R3.2 17.8,16.53 15.39,16.53 11.83,20.09 11.83,20.59 U$1.2 | 18.94,14.12 18.44,13.61 18.44,5.1 SPO2.9
SPO2_CONNECTION_A2
  Top 0.127: 31.9,15.9 33.93,15.9 R6.1 | 31.9,15.9 27.96,19.83 27.33,19.83 27.07,20.09 27.07,20.72 U4.8 | 31.9,15.9 31.9,13.99 28.09,10.18 28.09,8.02 SPO2.1
SPO2_IR
  Top 0.127: R9.1 38.76,25.04 38.76,16.66 28.6,6.5 26.69,6.5 25.29,7.89 SPO2.2
SPO2_LED_D10  (via drill 0.3)
  Top 0.127: U2.5 36.6,25.55 v36.6,25.04 36.6,21.99 34.95,20.34 34.95,19.83 U1.2 | v33.93,27.71 33.93,27.2 U2.13 | v27.96,27.96 27.96,29.23 U4.27
  Bottom 0.127: v36.6,25.04 34.8,26.84 | 34.8,26.84 v33.93,27.71 | v27.96,27.96 26.8,27.96 24.96,26.12 24.96,23.96 25.78,23.15 31.11,23.15 34.8,26.84
SPO2_LED_INV
  Top 0.127: 35.03,21.95 33.8,20.72 33.8,18.05 34.18,17.67 U1.4 | 35.03,21.95 35.96,22.88 35.96,24.91 U2.4 | 35.03,21.95 32.3,24.68 32.3,27.1 33.42,28.21 34.06,28.21 34.44,27.83 U2.12
SPO2_RED  (via drill 0.3)
  Top 0.127: 33.55,25.04 33.17,25.42 33.17,25.8 33.42,26.06 33.8,26.06 U2.15 | 33.55,25.04 34.44,25.04 U2.1 | v33.55,24.15 33.55,25.04
  Bottom 0.127: v33.55,24.15 33.55,19.07 22.5,8.02 SPO2.3
SWCLK  (via drill 0.3)
  Top 0.127: v9.93,23.77 21.99,23.77 U4.45 | v7.77,25.93 7.77,31.64 3.96,35.45 3.96,35.71 JP5.4
  Bottom 0.127: U$5.P$3 6.12,20.59 6.75,20.59 v9.93,23.77 v7.77,25.93
SWDIO  (via drill 0.3)
  Top 0.127: v20.85,23.26 21.99,23.26 U4.46
  Bottom 0.127: v20.85,23.26 20.85,26.06 16.28,30.63 10.31,30.63 3.96,36.98 JP5.2 3.83,37.11 3.2,37.74 2.31,37.74 1.55,36.98 1.55,31.64 5.8,27.39 5.8,24.59 5.99,24.41 U$5.P$2
USB_D_N
  Top 0.127: U4.33 25.02,30.33 21.17,34.18 17.42,34.18 16.79,34.82 14.01,34.82 10.34,38.49 10.34,38.68 10.44,38.78 J1.2
USB_D_P
  Top 0.127: U4.34 24.52,30.33 20.92,33.93 17.17,33.93 16.53,34.56 13.9,34.56 9.79,38.68 J1.3
VBUS  (via drill 0.3)
  Top 0.254: J1.1 11.37,39.51 11.37,38.65 11.87,38.16 12.32,38.16 v13.01,37.47 | C34.1 15.46,39.41 C4.1 17.5,38.93 U5.1 18.55,38.82 R48.1 17.91,37.65 v17.91,37.91 17.22,37.91 C35.1 | v30.54,42.21 36.45,42.21 v37.05,41.6
  Bottom 0.254: v13.01,37.47 14.03,38.49 18.69,38.49 | 18.69,38.49 19.71,38.49 21.18,37.02 23.69,37.02 25.89,39.21 25.89,40.89 27.27,42.27 30.48,42.27 v30.54,42.21 | 18.69,38.49 18.11,37.91 v17.91,37.91 | v37.05,41.6 37.04,41.59 SJ5.1
VDDANA
  Top 0.127: L2.2 28.85,17.67 28.09,18.44 26.95,18.44 C22.1 26.82,18.56 26.06,19.32 26.06,20.72 U4.6
VDDCORE
  Top 0.127: C21.1 19.2,25.04 21.1,25.04 21.23,24.91 21.99,24.91 U4.43

### Text on the board
_tsilk: SimModule SPO2 / Modular VitalSigns Box
_bsilk: SimModule SPO2 / Modular VitalSigns Box